# EAGLE design nRF52832_qfaa (EAGLE 8.3.0)
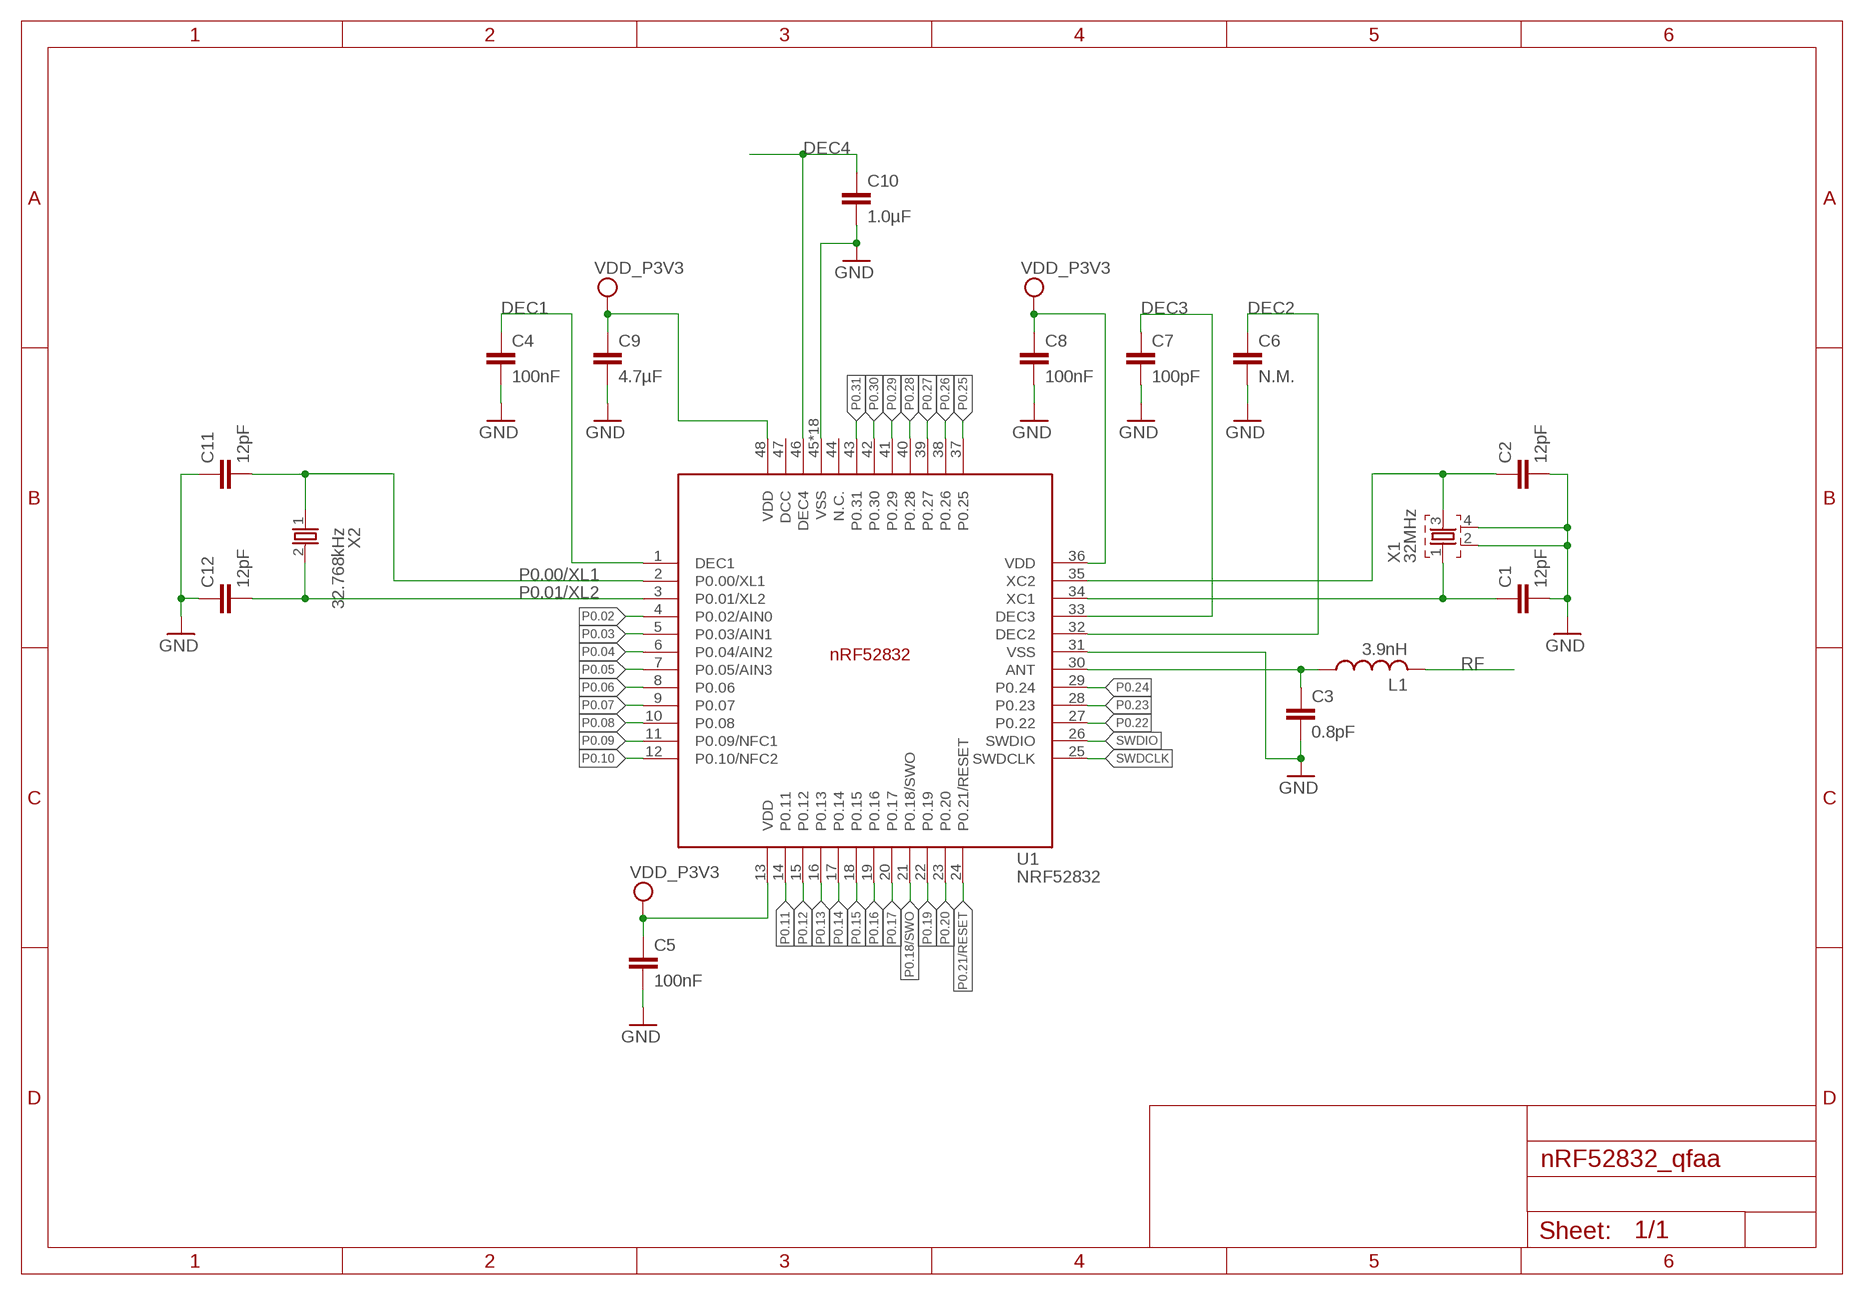
[diagram p0: schematic, sheet 1]

## Parts
C1  12pF  CAPACITOR_0402_N  [RESC0402_N]
C2  12pF  CAPACITOR_0402_N  [RESC0402_N]
C3  0.8pF  CAPACITOR_0402_N  [RESC0402_N]
C4  100nF  CAPACITOR_0402_N  [RESC0402_N]
C5  100nF  CAPACITOR_0402_N  [RESC0402_N]
C6  N.M.  CAPACITOR_0402_N  [RESC0402_N]
C7  100pF  CAPACITOR_0402_N  [RESC0402_N]
C8  100nF  CAPACITOR_0402_N  [RESC0402_N]
C9  4.7µF  CAPACITOR_0603_N  [RESC0603_N]
C10  1.0µF  CAPACITOR_0603_N  [RESC0603_N]
C11  12pF  CAPACITOR_0402_N  [RESC0402_N]
C12  12pF  CAPACITOR_0402_N  [RESC0402_N]
L1  3.9nH  INDUCTOR_0402_N  [RESC0402_N]
U1  NRF52832  [QFN40P600X600X90-48_N]
X1  32MHz  XTAL_32MHZ  [BT-XTAL_2016_N]
X2  32.768kHz  XTAL_32KHZ  [XTAL_3215_N]

## Nets
ANT: C3.1 L1.1 U1.30(ANT)
DEC1: C4.1 U1.1(DEC1)
DEC2: C6.1 U1.32(DEC2)
DEC3: C7.1 U1.33(DEC3)
DEC4: C10.1 U1.46(DEC4)
GND: C1.2 C2.2 C3.2 C4.2 C5.2 C6.2 C7.2 C8.2 C9.2 C10.2 C11.1 C12.1 U1.31(VSS) U1.45(VSS) U1.PAD(VSS) U1.PAD@VIA01(VSS) U1.PAD@VIA02(VSS) U1.PAD@VIA03(VSS) U1.PAD@VIA04(VSS) U1.PAD@VIA05(VSS) U1.PAD@VIA06(VSS) U1.PAD@VIA07(VSS) U1.PAD@VIA08(VSS) U1.PAD@VIA09(VSS) U1.PAD@VIA10(VSS) U1.PAD@VIA11(VSS) U1.PAD@VIA12(VSS) U1.PAD@VIA13(VSS) U1.PAD@VIA14(VSS) U1.PAD@VIA15(VSS) U1.PAD@VIA16(VSS) X1.2 X1.4
N$3: C2.1 U1.35(XC2) X1.3
P0.00/XL1: C11.2 U1.2(P0.00/XL1) X2.1
P0.01/XL2: C12.2 U1.3(P0.01/XL2) X2.2
P0.02: U1.4(P0.02/AIN0)
P0.03: U1.5(P0.03/AIN1)
P0.04: U1.6(P0.04/AIN2)
P0.05: U1.7(P0.05/AIN3)
P0.06: U1.8(P0.06)
P0.07: U1.9(P0.07)
P0.08: U1.10(P0.08)
P0.09: U1.11(P0.09/NFC1)
P0.10: U1.12(P0.10/NFC2)
P0.11: U1.14(P0.11)
P0.12: U1.15(P0.12)
P0.13: U1.16(P0.13)
P0.14: U1.17(P0.14)
P0.15: U1.18(P0.15)
P0.16: U1.19(P0.16)
P0.17: U1.20(P0.17)
P0.18/SWO: U1.21(P0.18/SWO)
P0.19: U1.22(P0.19)
P0.20: U1.23(P0.20)
P0.21/RESET: U1.24(P0.21/RESET)
P0.22: U1.27(P0.22)
P0.23: U1.28(P0.23)
P0.24: U1.29(P0.24)
P0.25: U1.37(P0.25)
P0.26: U1.38(P0.26)
P0.27: U1.39(P0.27)
P0.28: U1.40(P0.28)
P0.29: U1.41(P0.29)
P0.30: U1.42(P0.30)
P0.31: U1.43(P0.31)
RF: L1.2
SWDCLK: U1.25(SWDCLK)
SWDIO: U1.26(SWDIO)
VDD_P3V3: C5.1 C8.1 C9.1 U1.13(VDD) U1.36(VDD) U1.48(VDD)
X1: C1.1 U1.34(XC1) X1.1
Unconnected: U1.44(N.C.) U1.47(DCC)

## Library data of the parts
C1-C12 = Nordic_nRF:CAPACITOR: Generic chip capacitor
L1 = Nordic_nRF:INDUCTOR: Generic chip inductor
U1 = Nordic_nRF:NRF52832: nRF52832 Features Single chip, highly flexible, 2.4 GHz multi-protocol SoC 32-bit ARM Cortex-M4F Processor 1.7v to 3.6v operation 512kB flash + 64kB RAM Supports concurrent Bluetooth Smart/ANT protocol operation On-chip NFC tag for Out-of-Band (OOB) pairing Up to +4dBm output power -96dBm sensitivity, Bluetooth Smart Thread safe and run-time protected Event driven API On air compatible with nRF24L and nRF24AP series 2 data rates (2Mbps/1Mbps) PPI - maximum flexibility for power-efficient applications and code simplification Automated power management system with automatic power management of each peripheral Configurable I/O mapping for analog and digital I/O 3 x Master/Slave SPI 2 x Two-wire interface (I²C) UART (RTS/CTS) 3 x PWM AES HW encryption Real Time Counter (RTC) Digital microphone interface (PDM) On-chip balun Applications Internet of Things (IoT) Wearables SmartHome sensors Connected white goods Computer peripherals Voice-command smart remotes A4WP ‘Rezence’ wireless charging Beacons Sports and fitness sensors and hubs Connected health products Smart watches RC Toys Interactive games Building automation and sensor networks
X1 = Nordic_nRF:XTAL_32MHZ
X2 = Nordic_nRF:XTAL_32KHZ

## Board
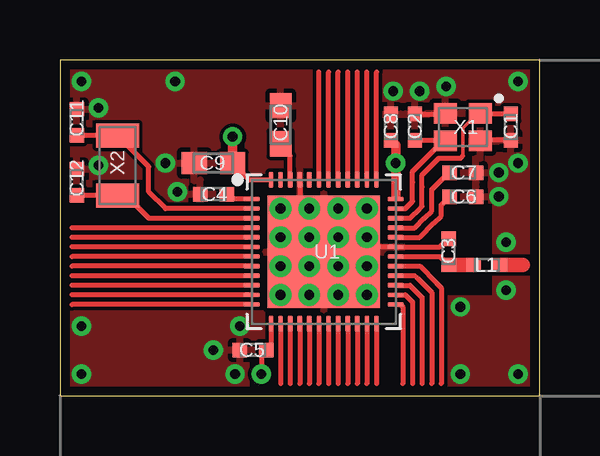
[diagram p1: board, top side]
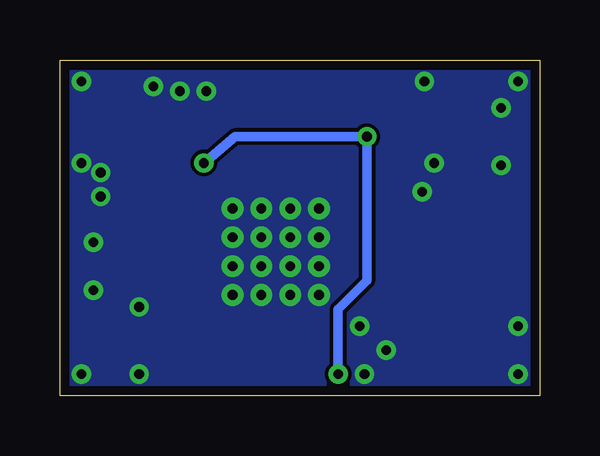
[diagram p2: board, bottom side, seen from below]

Size 20 x 14 mm. Coordinates in mm from the lower left corner, seen from the top.
Outline: 0,0 20,0 20,14 0,14 0,0
Copper layers (1*16): Top 0.035mm / dielectric 1.5mm / Bottom 0.035mm
Design rules "Nordic": minimum track width 0.15mm, minimum drill 0.4mm, track to track 0.15mm, track to pad 0.15mm, pad to pad 0.15mm, via to via 0.15mm, smd to smd 0.15mm, copper to edge 0.4mm, drill to drill 0.4mm, minimum pad ring 10mil, minimum via ring 8mil, stop-mask expansion 4mil, vias tented up to drill 0mil, thermal gap 0.2mm
tRestrict: area 14.4,4.2 to 18,8

### Footprints (pad centres in the part's own frame; a part is rotated, then mirrored left to right if it is on the bottom)
RESC0402_N = smd 0.6 x 0.6: 1 -0.55,0; 2 0.55,0
RESC0603_N = smd 1.05 x 0.9: 1 -0.8,0; 2 0.8,0
QFN40P600X600X90-48_N = smd 0.65 x 0.2: 1 -3,2.2; 2 -3,1.8; 3 -3,1.4; 4 -3,1; 5 -3,0.6; 6 -3,0.2; 7 -3,-0.2; 8 -3,-0.6; 9 -3,-1; 10 -3,-1.4; 11 -3,-1.8; 12 -3,-2.2; 25 3,-2.2; 26 3,-1.8; 27 3,-1.4; 28 3,-1; 29 3,-0.6; 30 3,-0.2; 31 3,0.2; 32 3,0.6; 33 3,1; 34 3,1.4; 35 3,1.8; 36 3,2.2 | smd 0.2 x 0.65: 13 -2.2,-3; 14 -1.8,-3; 15 -1.4,-3; 16 -1,-3; 17 -0.6,-3; 18 -0.2,-3; 19 0.2,-3; 20 0.6,-3; 21 1,-3; 22 1.4,-3; 23 1.8,-3; 24 2.2,-3; 37 2.2,3; 38 1.8,3; 39 1.4,3; 40 1,3; 41 0.6,3; 42 0.2,3; 43 -0.2,3; 44 -0.6,3; 45 -1,3; 46 -1.4,3; 47 -1.8,3; 48 -2.2,3 | smd 4.7 x 4.7: PAD 0,0 | drill 0.4: PAD@VIA01 -1.8,1.8; PAD@VIA02 -1.8,0.6; PAD@VIA03 -1.8,-0.6; PAD@VIA04 -1.8,-1.8; PAD@VIA05 -0.6,1.8; PAD@VIA06 -0.6,0.6; PAD@VIA07 -0.6,-0.6; PAD@VIA08 -0.6,-1.8; PAD@VIA09 0.6,1.8; PAD@VIA10 0.6,0.6; PAD@VIA11 0.6,-0.6; PAD@VIA12 0.6,-1.8; PAD@VIA13 1.8,1.8; PAD@VIA14 1.8,0.6; PAD@VIA15 1.8,-0.6; PAD@VIA16 1.8,-1.8
BT-XTAL_2016_N = smd 0.95 x 0.85: 1 -0.725,-0.575; 2 0.725,-0.575; 3 0.725,0.575; 4 -0.725,0.575
XTAL_3215_N = smd 1 x 1.8: 1 -1.25,0; 2 1.25,0

### Placement (x,y rotation side)
C1  18.8,11.2 270 top
C2  14.8,11.2 90 top
C3  16.2,6 90 top
C4  6.4,8.4 180 top
C5  8.05,1.9 180 top
C6  16.8,8.3 0 top
C7  16.8,9.3 0 top
C8  13.8,11.2 90 top
C9  6.4,9.7 180 top
C10  9.2,11.3 90 top
C11  0.7,11.4 270 top
C12  0.7,8.9 270 top
L1  17.8,5.45 0 top
U1  11,6 0 top
X1  16.8,11.2 180 top
X2  2.4,9.6 270 top

### Tracks (layer width: path | path; a pad name or v marks a point on that pad's centre or on a via)
ANT
  Top 0.2: U1.30 15.85,5.8 C3.1 16.25,5.45
  Top 0.6: L1.1 16.25,5.45
DEC1
  Top 0.2: U1.1 7.15,8.2 C4.1
DEC2
  Top 0.2: U1.32 15,6.6 15.6,7.2 15.9,7.5 15.9,7.7 15.9,7.95 C6.1
DEC3
  Top 0.2: U1.33 14.8,7 15.2,7.4 15.5,7.7 15.5,8.6 16.15,9.25 C7.1
DEC4
  Top 0.2: U1.46 9.6,10 C10.1
GND  (via drill 0.4 pad 0.8)
  Top 0.2: 12.85,6.19 U1.31 15.85,6.2 C3.2 | 12.85,6.19 arc-90 U1.PAD@VIA14 | 10.05,7.99 arc90 U1.PAD@VIA05 | U1.PAD@VIA01 10,7.8 | 10,7.8 U1.PAD@VIA05 | U1.PAD@VIA05 U1.PAD@VIA09 U1.PAD@VIA13 U1.PAD@VIA14 | U1.PAD@VIA02 U1.PAD@VIA06 | U1.PAD@VIA06 U1.PAD@VIA10 U1.PAD@VIA14 | 12.85,6.19 12.85,5.79 arc-90 U1.PAD@VIA15 | U1.PAD@VIA15 U1.PAD@VIA16 U1.PAD@VIA12 | U1.PAD@VIA15 U1.PAD@VIA11 U1.PAD@VIA07 U1.PAD@VIA03 U1.PAD@VIA04 U1.PAD@VIA08 | U1.PAD@VIA06 arc90 U1.PAD | U1.45 10,7.8 | C1.2 17.55,10.65 X1.4 | C2.2 16.05,11.75 X1.2 | 5.85,9.45 C9.2
  other vias: 1.6,9.6 1.6,12 4.4,9.7 13.9,12.7 18.3,9.3 18.3,8.3 4.9,8.5 19.1,9.7 16.1,12.9 15,12.7 7.3,0.9 7.5,2.9 18.6,4.4 18.6,6.4 0.9,13.1 4.8,13.1 19.1,13.1 16.7,3.7 19.1,0.9 16.7,0.9 6.4,1.9 0.9,0.9 0.9,2.9
  pour Top: 0,0 0,14 20,14 20,0
  pour Bottom: 0,0 0,14 20,14 20,0
N$3
  Top 0.2: U1.35 14.4,7.8 14.7,8.1 14.7,8.9 14.7,9.35 16,10.65 | C2.1 16,10.65 | 16,10.65 16.05,10.65 X1.3
P0.00/XL1
  Top 0.2: C11.2 X2.1 3.7,9.55 3.7,8.5 4.4,7.8 U1.2
P0.01/XL2
  Top 0.2: C12.2 X2.2 2.65,8.1 3,8.1 3.7,7.4 U1.3
P0.02
  Top 0.2: U1.4 0.5,7
P0.03
  Top 0.2: U1.5 0.5,6.6
P0.04
  Top 0.2: U1.6 0.5,6.2
P0.05
  Top 0.2: U1.7 0.5,5.8
P0.06
  Top 0.2: U1.8 0.5,5.4
P0.07
  Top 0.2: U1.9 0.5,5
P0.08
  Top 0.2: U1.10 0.5,4.6
P0.09
  Top 0.2: U1.11 0.5,4.2
P0.10
  Top 0.2: U1.12 0.5,3.8
P0.11
  Top 0.2: U1.14 9.2,0.5
P0.12
  Top 0.2: U1.15 9.6,0.5
P0.13
  Top 0.2: U1.16 10,0.5
P0.14
  Top 0.2: U1.17 10.4,0.5
P0.15
  Top 0.2: U1.18 10.8,0.5
P0.16
  Top 0.2: U1.19 11.2,0.5
P0.17
  Top 0.2: U1.20 11.6,0.5
P0.18/SWO
  Top 0.2: U1.21 12,0.5
P0.19
  Top 0.2: U1.22 12.4,0.5
P0.20
  Top 0.2: U1.23 12.8,0.5
P0.21/RESET
  Top 0.2: U1.24 13.2,0.5
P0.22
  Top 0.2: U1.27 14.6,4.6 15.1,4.1 15.1,0.5
P0.23
  Top 0.2: U1.28 14.8,5 14.9,4.9 15.5,4.3 15.5,0.5
P0.24
  Top 0.2: U1.29 15,5.4 15.7,4.7 15.8,4.6 15.9,4.5 15.9,0.5
P0.25
  Top 0.2: U1.37 13.2,13.5
P0.26
  Top 0.2: U1.38 12.8,13.5
P0.27
  Top 0.2: U1.39 12.4,13.5
P0.28
  Top 0.2: U1.40 12,13.5
P0.29
  Top 0.2: U1.41 11.6,13.5
P0.30
  Top 0.2: U1.42 11.2,13.5
P0.31
  Top 0.2: U1.43 10.8,13.5
RF
  Top 0.6: L1.2 19.3,5.45
SWDCLK
  Top 0.2: U1.25 14.2,3.8 14.3,3.7 14.3,0.5
SWDIO
  Top 0.2: U1.26 14.4,4.2 14.7,3.9 14.7,0.5
VDD_P3V3  (via drill 0.4 pad 0.8)
  Top 0.2: U1.48 7.9,9 C9.1 | U1.36 14,8.3 | U1.13 8.8,1.9 C5.1 8.4,1.9 v8.4,0.9
  Top 0.4: 14,8.3 v14,9.7 14,10.45 C8.1 | v7.2,10.8 C9.1
  Bottom 0.4: v8.4,0.9 8.4,3.6 7.2,4.8 v7.2,10.8 12.7,10.8 v14,9.7
X1
  Top 0.15: 16.8,10 16.8,11.15 17.43,11.78 X1.1
  Top 0.2: C1.1 17.55,11.75 X1.1 | U1.34 14.6,7.4 15,7.8 15.1,7.9 15.1,8.7 15.1,9.2 15.8,9.9 16.7,9.9 16.8,10